# EAGLE design RFM2Pi_v2.7.1 (EAGLE 7.0.0)
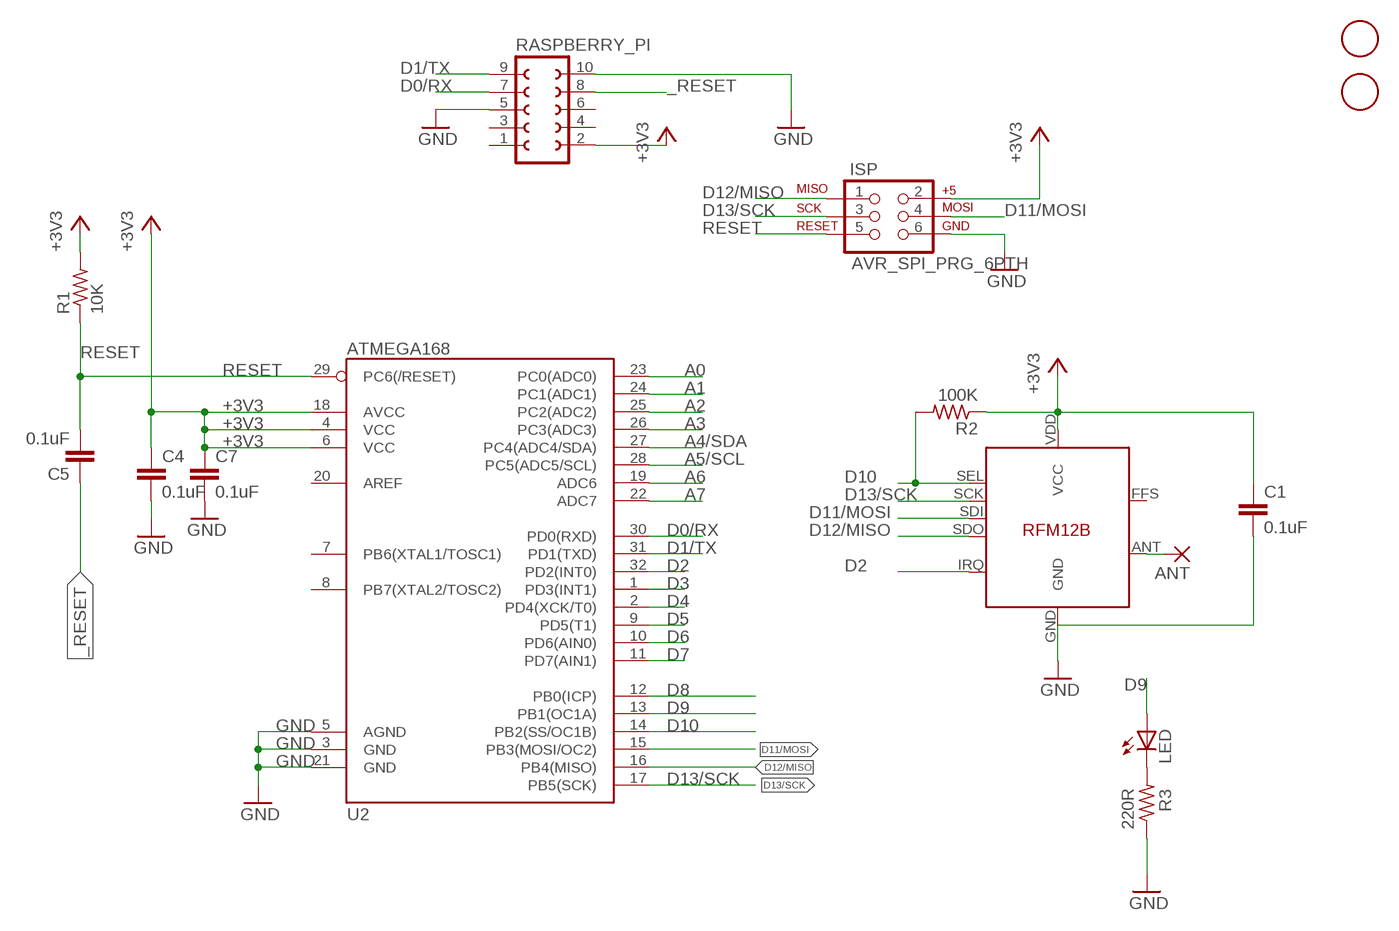
[diagram p0: schematic, sheet 1]

## Parts
ANT  1,6/0,8  [1,6/0,8]
C1  0.1uF  C-EUC0603  [C0603]
C4  0.1uF  C-EUC0603  [C0603]
C5  0.1uF  C-EUC0603  [C0603]
C7  0.1uF  C-EUC0603  [C0603]
ISP  AVR_SPI_PRG_6PTH  [2X3]
LED  LEDSML0603  [SML0603]
R1  10K  R-US_R0603  [R0603]
R2  100K  R-US_R0603  [R0603]
R3  220R  R-US_R0603  [R0603]
RASPBERRY_PI  FE05-2  [FE05-2]
RFM12B  RFM12B  [RFM12B]
U2  ATMEGA168  [TQFP32-08]
U$1  FIDUCIAL  [FIDUCIAL_1MM]
U$2  FIDUCIAL  [FIDUCIAL_1MM]

## Nets
+3V3 [power]: C1.1 C4.1 C7.1 ISP.2 R1.2 R2.1 RASPBERRY_PI.2 RFM12B.VDD(VCC) U2.4(VCC) U2.6(VCC) U2.18(AVCC)
_RESET: C5.1 RASPBERRY_PI.8
A0: U2.23(PC0(ADC0))
A1: U2.24(PC1(ADC1))
A2: U2.25(PC2(ADC2))
A3: U2.26(PC3(ADC3))
A4/SDA: U2.27(PC4(ADC4/SDA))
A5/SCL: U2.28(PC5(ADC5/SCL))
A6: U2.19(ADC6)
A7: U2.22(ADC7)
D0/RX: RASPBERRY_PI.7 U2.30(PD0(RXD))
D1/TX: RASPBERRY_PI.9 U2.31(PD1(TXD))
D2: RFM12B.IRQ U2.32(PD2(INT0))
D3: U2.1(PD3(INT1))
D4: U2.2(PD4(XCK/T0))
D5: U2.9(PD5(T1))
D6: U2.10(PD6(AIN0))
D7: U2.11(PD7(AIN1))
D8: U2.12(PB0(ICP))
D9: LED.A U2.13(PB1(OC1A))
D10: R2.2 RFM12B.SEL U2.14(PB2(SS/OC1B))
D11/MOSI: ISP.4 RFM12B.SDI U2.15(PB3(MOSI/OC2))
D12/MISO: ISP.1 RFM12B.SDO U2.16(PB4(MISO))
D13/SCK: ISP.3 RFM12B.SCK U2.17(PB5(SCK))
GND [power]: C1.2 C4.2 C7.2 ISP.6 R3.1 RASPBERRY_PI.5 RASPBERRY_PI.10 RFM12B.GND U2.3(GND) U2.5(AGND) U2.21(GND)
N$3: LED.C R3.2
N$6 [power]: ANT.1(P) RFM12B.ANT
RESET: C5.2 ISP.5 R1.1 U2.29(PC6(/RESET))
Unconnected: RASPBERRY_PI.1 RASPBERRY_PI.3 RASPBERRY_PI.4 RASPBERRY_PI.6 RFM12B.FFS U2.7(PB6(XTAL1/TOSC1)) U2.8(PB7(XTAL2/TOSC2)) U2.20(AREF)

## Library data of the parts
ANT = JeeLabs:1,6/0,8: THROUGH-HOLE PAD
C1 C4 C5 = rcl:C-EU: CAPACITOR, European symbol
C7 = resistor:C-EU: CAPACITOR, European symbol
ISP = SparkFun:AVR_SPI_PRG_6: AVR ISP 6 Pin This is the reduced ISP connector for AVR programming. Common on Arduino. This footprint will take up less PCB space and can be used with a 10-pin to 6-pin adapter such as SKU: BOB-08508
LED = led:LED: LED OSRAM: - CHIPLED LG R971, LG N971, LY N971, LG Q971, LY Q971, LO R971, LY R971 LH N974, LH R974 LS Q976, LO Q976, LY Q976 LO Q996 - Hyper CHIPLED LW Q18S LB Q993, LB Q99A, LB R99A - SideLED LS A670, LO A670, LY A670, LG A670, LP A670 LB A673, LV A673, LT A673, LW A673 LH A674 LY A675 LS A676, LA A676, LO A676, LY A676, LW A676 LS A679, LY A679, LG A679 - Hyper Micro SIDELED® LS Y876, LA Y876, LO Y876, LY Y876 LT Y87S - SmartLED LW L88C, LW L88S LB L89C, LB L89S, LG L890 LS L89K, LO L89K, LY L89K LS L896, LA L896, LO L896, LY L896 - TOPLED LS T670, LO T670, LY T670, LG T670, LP T670 LSG T670, LSP T670, LSY T670, LOP T670, LYG T670 LG T671, LOG T671, LSG T671 LB T673, LV T673, LT T673, LW T673 LH T674 LS T676, LA T676, LO T676, LY T676, LB T676, LH T676, LSB T676, LW T676 LB T67C, LV T67C, LT T67C, LS T67K, LO T67K, LY T67K, LW E67C LS E67B, LA E67B, LO E67B, LY E67B, LB E67C, LV E67C, LT E67C LW T67C LS T679, LY T679, LG T679 LS T770, LO T770, LY T770, LG T770, LP T770 LB T773, LV T773, LT T773, LW T773 LH T774 LS E675, LA E675, LY E675, LS T675 LS T776, LA T776, LO T776, LY T776, LB T776 LHGB T686 LT T68C, LB T68C - Hyper Mini TOPLED® LB M676 - Mini TOPLED Santana® LG M470 LS M47K, LO M47K, LY M47K Source: http://www.osram.convergy.de LUXEON: - LUMILED® LXK2-PW12-R00, LXK2-PW12-S00, LXK2-PW14-U00, LXK2-PW14-V00 LXK2-PM12-R00, LXK2-PM12-S00, LXK2-PM14-U00 LXK2-PE12-Q00, LXK2-PE12-R00, LXK2-PE12-S00, LXK2-PE14-T00, LXK2-PE14-U00 LXK2-PB12-K00, LXK2-PB12-L00, LXK2-PB12-M00, LXK2-PB14-N00, LXK2-PB14-P00, LXK2-PB14-Q00 LXK2-PR12-L00, LXK2-PR12-M00, LXK2-PR14-Q00, LXK2-PR14-R00 LXK2-PD12-Q00, LXK2-PD12-R00, LXK2-PD12-S00 LXK2-PH12-R00, LXK2-PH12-S00 LXK2-PL12-P00, LXK2-PL12-Q00, LXK2-PL12-R00 Source: www.luxeon.com KINGBRIGHT: KA-3528ASYC Source: www.kingbright.com
R1-R3 = adafruit:R-US_: RESISTOR, American symbol
RASPBERRY_PI = con-lsta:FE05-2: FEMALE HEADER; OC_FARNELL: unknown; OC_NEWARK: unknown
RFM12B = JeeLabs:RFM12B
U2 = SparkFun:ATMEGA168
U$1 U$2 = adafruit:FIDUCIAL: For use by pick and place machines to calibrate the vision/machine, 1mm By microbuilder.eu

## Net classes
0 default: width 0.254 mm, drill 0.254 mm, clearance 0.254 mm
1 power: width 0.305 mm, drill 0.305 mm, clearance 0.305 mm

## Board
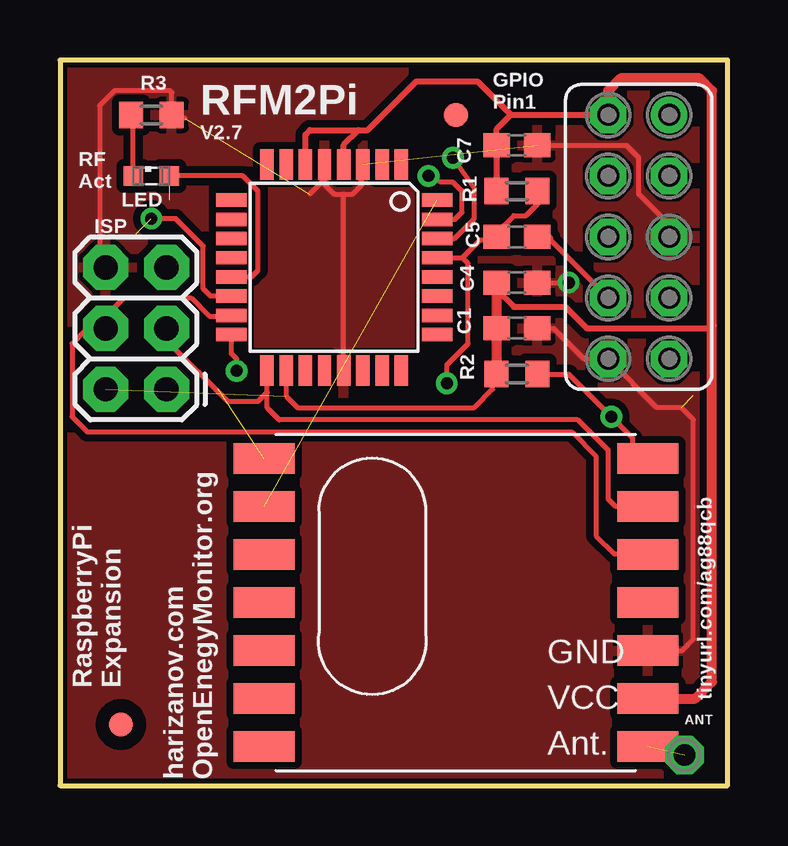
[diagram p1: board, top side]
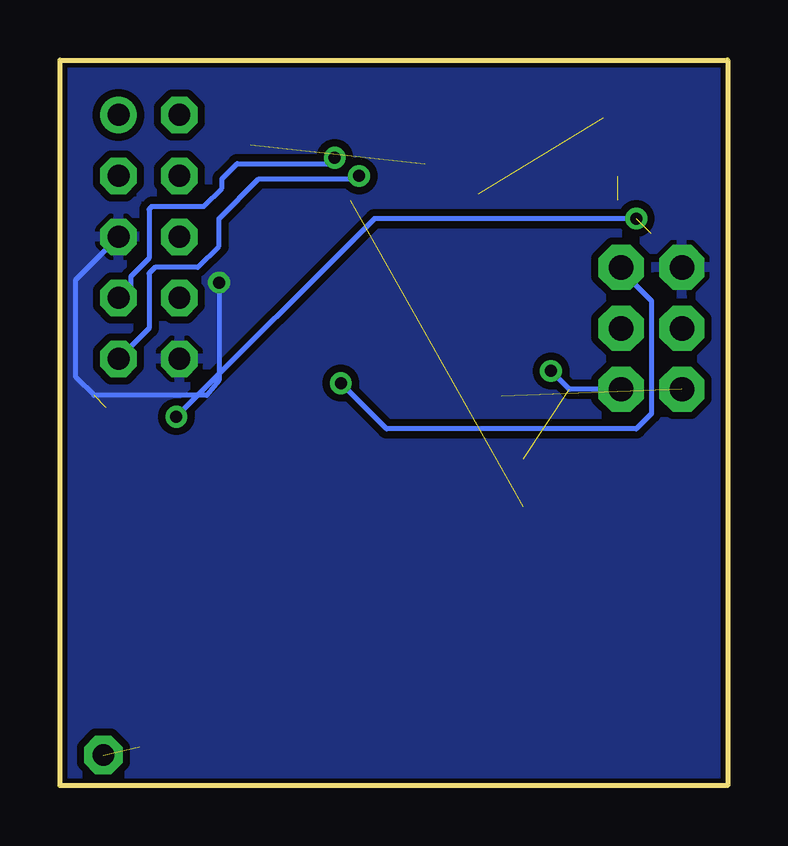
[diagram p2: board, bottom side, seen from below]

Size 27.84 x 30.23 mm. Coordinates in mm from the lower left corner, seen from the top.
Outline: 0,30.23 0,0 27.84,0 27.84,30.23 0,30.23
Copper layers (1*16): Top 0.035mm / dielectric 1.5mm / Bottom 0.035mm
Design rules "default": minimum track width 8mil, minimum drill 0.6mm, track to track 8mil, track to pad 8mil, pad to pad 8mil, via to via 8mil, smd to smd 8mil, copper to edge 8mil, drill to drill 8mil, minimum pad ring 12mil, minimum via ring 8mil, stop-mask expansion 4mil, vias tented up to drill 0mil, thermal gap 8mil

### Footprints (pad centres in the part's own frame; a part is rotated, then mirrored left to right if it is on the bottom)
1,6/0,8 = drill 0.9 pad 1.6 octagon: 1 0,0
C0603 = smd 1.1 x 1: 1 -0.85,0; 2 0.85,0
2X3 = drill 1.016 pad 1.88 octagon: 1 0,0; 2 0,2.54; 3 2.54,0; 4 2.54,2.54; 5 5.08,0; 6 5.08,2.54
SML0603 = smd 0.8 x 0.8: A 0.75,0; C -0.75,0
R0603 = smd 1 x 1.1: 1 -0.85,0; 2 0.85,0
FE05-2 = drill 0.914: 1 -5.08,1.27 | drill 0.914 octagon: 2 -5.08,-1.27; 3 -2.54,1.27; 4 -2.54,-1.27; 5 0,1.27; 6 0,-1.27; 7 2.54,1.27; 8 2.54,-1.27; 9 5.08,1.27; 10 5.08,-1.27
RFM12B = smd 2.54 x 1.27: ANT 8,-6; FFS -8,2; GND 8,-2; IRQ -8,4; P$8 -8,0; P$9 -8,-2; P$10 -8,-4; P$12 -8,-6; P$16 8,0; SCK 8,4; SDI 8,2; SDO -8,6; SEL 8,6; VDD 8,-4
TQFP32-08 = smd 1.27 x 0.559: 1 -4.293,2.8; 2 -4.293,2; 3 -4.293,1.2; 4 -4.293,0.4; 5 -4.293,-0.4; 6 -4.293,-1.2; 7 -4.293,-2; 8 -4.293,-2.8; 17 4.293,-2.8; 18 4.293,-2; 19 4.293,-1.2; 20 4.293,-0.4; 21 4.293,0.4; 22 4.293,1.2; 23 4.293,2; 24 4.293,2.8 | smd 0.559 x 1.27: 9 -2.8,-4.293; 10 -2,-4.293; 11 -1.2,-4.293; 12 -0.4,-4.293; 13 0.4,-4.293; 14 1.2,-4.293; 15 2,-4.293; 16 2.8,-4.293; 25 2.8,4.293; 26 2,4.293; 27 1.2,4.293; 28 0.4,4.293; 29 -0.4,4.293; 30 -1.2,4.293; 31 -2,4.293; 32 -2.8,4.293
FIDUCIAL_1MM = smd 1 x 1: 1 0,0

### Placement (x,y rotation side)
ANT  26.04,1.27 0 top
C1  19.05,19.05 0 top
C4  19.05,20.96 0 top
C5  19.05,22.86 180 top
C7  19.05,26.67 0 top
ISP  4.45,16.51 90 top
LED  3.81,25.4 0 top
R1  19.05,24.77 180 top
R2  19.05,17.14 0 top
R3  3.81,27.94 180 top
RASPBERRY_PI  24.13,22.86 270 top
RFM12B  16.51,7.62 0 top
U2  11.43,21.59 270 top
U$1  16.51,27.94 0 top
U$2  2.54,2.54 0 top

### Tracks (layer width: path | path; a pad name or v marks a point on that pad's centre or on a via)
+3V3  (1 unrouted)
  Top 0.203: U2.18 9.43,16.22 9.91,15.75 17.27,15.75 18.03,16.51 18.03,16.98 R2.1
  Top 0.254: C7.1 R1.2 | C7.1 18.2,27.34 18.8,27.94 | 18.8,27.94 RASPBERRY_PI.2 | U2.6 10.23,27.12 10.41,27.3 12.45,27.3 | 18.07,26.54 C7.1 | U2.4 11.83,26.69 12.45,27.3 | 12.45,27.3 12.83,27.3 14.86,29.34 17.4,29.34 18.8,27.94 | C4.1 18.2,20.66 18.92,19.94 21.08,19.94 21.97,19.05 27.05,19.05 27.18,19.18
  Top 0.406: RFM12B.VDD 26.48,3.62 27.18,4.32 27.18,19.18 27.18,28.96 26.67,29.46 23.37,29.46 22.86,28.96 RASPBERRY_PI.2 | R2.1 C1.1 C4.1
_RESET
  Top 0.203: C5.1 20.45,22.86 20.45,22.73 RASPBERRY_PI.8
D0/RX  (via drill 0.5)
  Top 0.203: U2.30 16.44,22.79 17.27,23.62 17.27,24.89 v16.38,26.16
  Bottom 0.203: RASPBERRY_PI.7 24.89,20.83 24.89,21.21 24.13,21.97 24.13,24 24,24.13 21.84,24.13 21.08,24.89 21.08,25.27 20.45,25.91 16.64,25.91 v16.38,26.16
D1/TX  (via drill 0.5)
  Top 0.203: U2.31 16.48,23.59 16.76,23.88 16.76,24.77 16.38,25.15 15.88,25.15 v15.37,25.4
  Bottom 0.203: RASPBERRY_PI.9 24.13,19.05 24.13,21.34 23.88,21.59 22.1,21.59 21.21,22.48 21.21,23.62 19.56,25.27 15.49,25.27 v15.37,25.4
D2  (1 unrouted)
D9  (1 unrouted)
  Top 0.203: 4.57,25.39 LED.A 7.62,25.4 8.26,24.77 8.26,21.46 7.98,21.19 U2.13
D10  (via drill 0.5)  (1 unrouted)
  Top 0.203: RFM12B.SEL 24.41,13.72 23.88,13.72 23.88,14.48 v22.99,15.37 21.21,17.14 R2.2 | U2.14 6.28,20.39 5.97,20.7 5.97,22.48 4.83,23.62 v3.81,23.62
  Bottom 0.203: v3.81,23.62 14.73,23.62 v22.99,15.37
D11/MOSI
  Top 0.203: RFM12B.SDI 24.48,9.65 23.11,9.65 22.35,10.41 22.35,13.72 21.34,14.73 1.14,14.73 0.51,15.37 0.51,18.41 1.02,18.92 1.78,18.92 ISP.4 1.9,19.56 2.67,20.32 5.46,20.32 6.22,19.56 7.11,19.56 U2.15
D12/MISO  (via drill 0.5)  (1 unrouted)
  Top 0.203: U2.16 7.14,18.01 7.37,17.78 v7.37,17.27
  Bottom 0.203: ISP.1 6.6,16.51 v7.37,17.27
D13/SCK
  Top 0.203: 8.64,16.38 8.64,15.75 9.14,15.24 21.59,15.24 22.86,13.97 22.86,11.94 23.18,11.62 RFM12B.SCK | 8.64,16.38 U2.17 | ISP.3 4.45,18.54 6.99,16 8.26,16 8.64,16.38
GND  (via drill 0.5)  (3 unrouted)
  Top 0.203: RFM12B.GND 25.94,5.62 26.42,6.1 26.42,15.24 25.91,15.75 24.89,15.75 RASPBERRY_PI.10 21.84,17.78 20.57,19.05 C1.2 | 11.81,24.64 11.43,24.64 11.03,25.04 U2.5 11.03,25.25 10.41,24.64 | 11.81,24.64 12.19,24.64 12.57,25.02 12.57,25.83 U2.3 | 20.32,20.96 C4.2 v21.21,20.96 | RASPBERRY_PI.5 25.4,23.37 24.13,24.64 24.13,26.16 23.62,26.67 C7.2 | ISP.6 1.65,21.84 1.65,28.32 2.29,28.96 4.57,28.96 4.66,28.87 R3.1 4.79,27.81 5.21,27.81 | U2.21 11.83,24.62 11.81,24.64
  Bottom 0.203: v21.21,20.96 21.21,16.89 21.72,16.26 26.42,16.26 27.18,17.02 27.18,21.08 RASPBERRY_PI.5
  pour Top (isolate 0): -1.14,31.75 -1.4,31.75 -1.4,-1.52 29.34,-1.52 29.34,31.62 -1.27,31.62
  pour Bottom (isolate 0): -0.51,31.5 28.83,31.5 28.83,-0.64 -0.51,-0.64
N$3
  Top 0.203: LED.C 3.06,27.84 R3.2
N$6  (1 unrouted)
RESET  (via drill 0.5)
  Top 0.203: U2.29 16.78,21.99 | 16.78,21.99 17.53,22.73 18.07,22.73 C5.2 18.2,23.03 18.92,23.75 19.43,23.75 19.94,24.26 19.94,24.73 R1.1 | v16.13,16.76 16.13,17.53 17.02,18.41 17.02,21.75 16.78,21.99
  Bottom 0.203: ISP.5 4.45,21.46 3.18,20.19 3.18,15.49 3.81,14.86 14.22,14.86 v16.13,16.76

### Text on the board
_tsilk: RFM2Pi | GPIO / Pin1 | V2.7 | RF / Act | RaspberryPi / Expansion | tinyurl.com/ag88qcb | harizanov.com / OpenEnegyMonitor.org